# Altium schematic sheet AFE Chip.SchDoc
size A; SheetNumber: 1; SheetTotal: 4
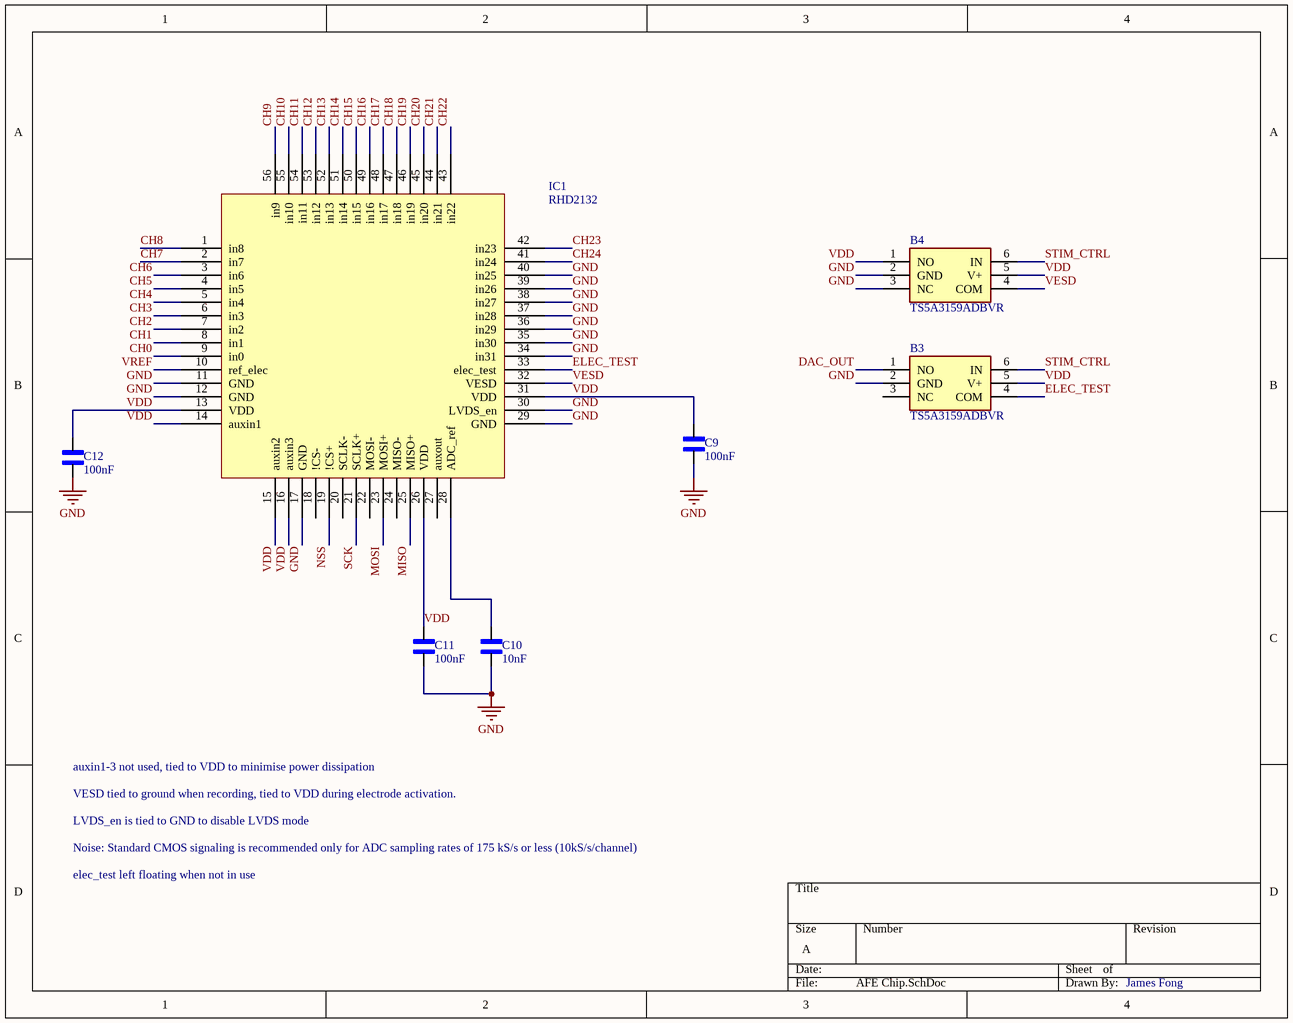
[diagram p0: AFE Chip.SchDoc]

## Parts
B3  TS5A3159ADBVR  [SOT95P280X145-6N]
B4  TS5A3159ADBVR  [SOT95P280X145-6N]
C9  value 100nF  [CAPC2012X88N]  (hidden comment: C0805C104K6RACTU)
C10  value 10nF  [CAPC2012X88N]  (hidden comment: C0805C103J5RACTU)
C11  value 100nF  [CAPC2012X88N]  (hidden comment: C0805C104K6RACTU)
C12  value 100nF  [CAPC2012X88N]  (hidden comment: C0805C104K6RACTU)
IC1  RHD2132  [RHD2216]

## Nets
GND: B3.2(GND) B4.2(GND) B4.3(NC) C9.1 C10.1 C11.1 C12.1 IC1.11(GND) IC1.12(GND) IC1.17(GND) IC1.29(GND) IC1.30(LVDS_en) IC1.34(in31) IC1.35(in30) IC1.36(in29) IC1.37(in28) IC1.38(in27) IC1.39(in26) IC1.40(in25)
CH0: IC1.9(in0)
CH1: IC1.8(in1)
CH2: IC1.7(in2)
CH3: IC1.6(in3)
CH4: IC1.5(in4)
CH5: IC1.4(in5)
CH6: IC1.3(in6)
CH7: IC1.2(in7)
CH8: IC1.1(in8)
CH9: IC1.56(in9)
CH10: IC1.55(in10)
CH11: IC1.54(in11)
CH12: IC1.53(in12)
CH13: IC1.52(in13)
CH14: IC1.51(in14)
CH15: IC1.50(in15)
CH16: IC1.49(in16)
CH17: IC1.48(in17)
CH18: IC1.47(in18)
CH19: IC1.46(in19)
CH20: IC1.45(in20)
CH21: IC1.44(in21)
CH22: IC1.43(in22)
CH23: IC1.42(in23)
CH24: IC1.41(in24)
DAC_OUT: B3.1(NO)
ELEC_TEST: B3.4(COM) IC1.33(elec_test)
MISO: IC1.25(MISO+)
MOSI: IC1.23(MOSI+)
NSS: IC1.19(!CS+)
SCK: IC1.21(SCLK+)
STIM_CTRL: B3.6(IN) B4.6(IN)
VDD: B3.5(V+) B4.1(NO) B4.5(V+) C9.2 C11.2 C12.2 IC1.13(VDD) IC1.14(auxin1) IC1.15(auxin2) IC1.16(auxin3) IC1.26(VDD) IC1.31(VDD)
VESD: B4.4(COM) IC1.32(VESD)
VREF: IC1.10(ref_elec)
NetC10_2: C10.2 IC1.28(ADC_ref)

Not connected (* = marked no-connect by the designer): B3 3(NC); IC1 18(!CS-) 20(SCLK-) 22(MOSI-) 24(MISO-) 27(auxout)

## Notes on the sheet
- auxin1-3 not used, tied to VDD to minimise power dissipation
- LVDS_en is tied to GND to disable LVDS mode
- VESD tied to ground when recording, tied to VDD during electrode activation.
- Noise: Standard CMOS signaling is recommended only for ADC sampling rates of 175 kS/s or less (10kS/s/channel)
- elec_test left floating when not in use
- James Fong

## Library data of the parts
B3 B4 = CMP-011-00015-2: 1 Ohm SPDT Analog Switch 5-V/3.3-V Single Channel 2:1 Multiplexer/Demultiplexer; Manufacturer_Name: Texas Instruments; Geometry.Height: 1.45mm; Source: TS5A3159ADBVR.SchLib; Farnell Price/Stock: *; Farnell Part Number: *; Design Item ID: TS5A3159ADBVR; Datasheet Link: http://www.ti.com/lit/gpn/ts5a3159a; Manufacturer_Part_Number: TS5A3159ADBVR
C9 C11 C12 = CMP-001-00084-1: 0.1 ÂµF Â±10% 35V Ceramic Capacitor X7R 0805 (2012 Metric); MF: KEMET; Source: C0805C104K6RACTU.SchLib; SnapEDA_Link: https://www.snapeda.com/parts/C0805C104K6RACTU/KEMET/view-part/?ref=snap; MP: C0805C104K6RACTU; Pins: 2; Check_prices: https://www.snapeda.com/parts/C0805C104K6RACTU/KEMET/view-part/?ref=eda; Case/Package: 805-2 KEMET; Design Item ID: C0805C104K6RACTU; Component Type: Standard
C10 = CMP-001-00083-1: Capacitor;Ceramic;Cap 0.01uF;Tol 5%;Vol-Rtg 50 V;SMT;Case 0805;X7R;TR; MF: KEMET; Design Item ID: C0805C103J5RACTU; Pins: 2; Source: C0805C103J5RACTU.SchLib; Check_prices: https://www.snapeda.com/parts/C0805C103J5RACTU/KEMET/view-part/?ref=eda; Case/Package: 805-2 KEMET; MP: C0805C103J5RACTU; Component Type: Standard; SnapEDA_Link: https://www.snapeda.com/parts/C0805C103J5RACTU/KEMET/view-part/?ref=snap